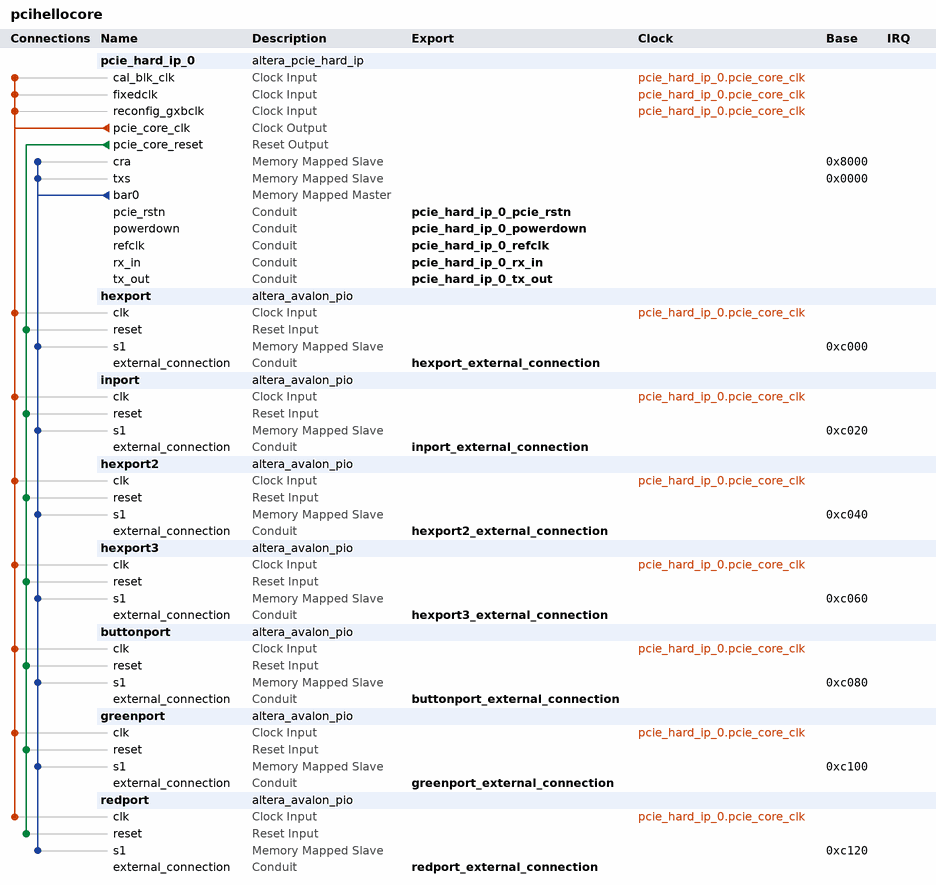
[diagram p0: system contents]
# Platform Designer (Qsys) system pcihellocore, Cyclone IV GX EP4CGX150DF31C7
# Parameters at their usual value, and those the tool derives, are not listed.
package require -exact qsys 20.1
create_system pcihellocore
set_project_property DEVICE_FAMILY {Cyclone IV GX}
set_project_property DEVICE EP4CGX150DF31C7

add_instance pcie_hard_ip_0 altera_pcie_hard_ip 20.1
set_instance_parameter_value pcie_hard_ip_0 {BAR Type} {32 bit Non-Prefetchable,Not used,Not used,Not used,Not used,Not used}
set_instance_parameter_value pcie_hard_ip_0 CB_A2P_ADDR_MAP_PASS_THRU_BITS 15
set_instance_parameter_value pcie_hard_ip_0 CG_ENABLE_A2P_INTERRUPT 0
set_instance_parameter_value pcie_hard_ip_0 CG_NO_CPL_REORDERING 0
set_instance_parameter_value pcie_hard_ip_0 {PCIe Address 31:0} 0x00000000,0x00000000,0x00000000,0x00000000,0x00000000,0x00000000,0x00000000,0x00000000,0x00000000,0x00000000,0x00000000,0x00000000,0x00000000,0x00000000,0x00000000,0x00000000
set_instance_parameter_value pcie_hard_ip_0 {PCIe Address 63:32} 0x00000000,0x00000000,0x00000000,0x00000000,0x00000000,0x00000000,0x00000000,0x00000000,0x00000000,0x00000000,0x00000000,0x00000000,0x00000000,0x00000000,0x00000000,0x00000000
set_instance_parameter_value pcie_hard_ip_0 class_code 0
set_instance_parameter_value pcie_hard_ip_0 device_id 4
set_instance_parameter_value pcie_hard_ip_0 my_advanced_errors false
set_instance_parameter_value pcie_hard_ip_0 my_enable_ecrc_check false
set_instance_parameter_value pcie_hard_ip_0 my_enable_ecrc_gen false
set_instance_parameter_value pcie_hard_ip_0 p_pcie_app_clk 1
set_instance_parameter_value pcie_hard_ip_0 p_pcie_test_out_width None
set_instance_parameter_value pcie_hard_ip_0 p_user_msi_enable 0
set_instance_parameter_value pcie_hard_ip_0 subsystem_device_id 4
set_instance_parameter_value pcie_hard_ip_0 subsystem_vendor_id 4466
set_instance_parameter_value pcie_hard_ip_0 vendor_id 4466

add_instance hexport altera_avalon_pio 20.1
set_instance_parameter_value hexport direction Output
set_instance_parameter_value hexport resetValue 1077952576
set_instance_parameter_value hexport width 32

add_instance inport altera_avalon_pio 20.1
set_instance_parameter_value inport direction Input
set_instance_parameter_value inport width 16

add_instance hexport2 altera_avalon_pio 20.1
set_instance_parameter_value hexport2 direction Output
set_instance_parameter_value hexport2 resetValue 16448
set_instance_parameter_value hexport2 width 16

add_instance hexport3 altera_avalon_pio 20.1
set_instance_parameter_value hexport3 direction Output
set_instance_parameter_value hexport3 resetValue 16448
set_instance_parameter_value hexport3 width 16

add_instance buttonport altera_avalon_pio 20.1
set_instance_parameter_value buttonport direction Output
set_instance_parameter_value buttonport resetValue 17
set_instance_parameter_value buttonport width 8

add_instance greenport altera_avalon_pio 20.1
set_instance_parameter_value greenport direction Output
set_instance_parameter_value greenport resetValue 255
set_instance_parameter_value greenport width 8

add_instance redport altera_avalon_pio 20.1
set_instance_parameter_value redport direction Output
set_instance_parameter_value redport resetValue 65535
set_instance_parameter_value redport width 16

# connections
add_connection pcie_hard_ip_0.pcie_core_clk buttonport.clk clock
add_connection pcie_hard_ip_0.pcie_core_clk greenport.clk clock
add_connection pcie_hard_ip_0.pcie_core_clk hexport2.clk clock
add_connection pcie_hard_ip_0.pcie_core_clk hexport3.clk clock
add_connection pcie_hard_ip_0.pcie_core_clk hexport.clk clock
add_connection pcie_hard_ip_0.pcie_core_clk inport.clk clock
add_connection pcie_hard_ip_0.pcie_core_clk pcie_hard_ip_0.cal_blk_clk clock
add_connection pcie_hard_ip_0.pcie_core_clk pcie_hard_ip_0.fixedclk clock
add_connection pcie_hard_ip_0.pcie_core_clk pcie_hard_ip_0.reconfig_gxbclk clock
add_connection pcie_hard_ip_0.pcie_core_clk redport.clk clock
add_connection pcie_hard_ip_0.pcie_core_reset buttonport.reset reset
add_connection pcie_hard_ip_0.pcie_core_reset greenport.reset reset
add_connection pcie_hard_ip_0.pcie_core_reset hexport2.reset reset
add_connection pcie_hard_ip_0.pcie_core_reset hexport3.reset reset
add_connection pcie_hard_ip_0.pcie_core_reset hexport.reset reset
add_connection pcie_hard_ip_0.pcie_core_reset inport.reset reset
add_connection pcie_hard_ip_0.pcie_core_reset redport.reset reset
add_connection pcie_hard_ip_0.bar0 buttonport.s1 avalon
set_connection_parameter_value pcie_hard_ip_0.bar0/buttonport.s1 baseAddress 0xc080
add_connection pcie_hard_ip_0.bar0 greenport.s1 avalon
set_connection_parameter_value pcie_hard_ip_0.bar0/greenport.s1 baseAddress 0xc100
add_connection pcie_hard_ip_0.bar0 hexport2.s1 avalon
set_connection_parameter_value pcie_hard_ip_0.bar0/hexport2.s1 baseAddress 0xc040
add_connection pcie_hard_ip_0.bar0 hexport3.s1 avalon
set_connection_parameter_value pcie_hard_ip_0.bar0/hexport3.s1 baseAddress 0xc060
add_connection pcie_hard_ip_0.bar0 hexport.s1 avalon
set_connection_parameter_value pcie_hard_ip_0.bar0/hexport.s1 baseAddress 0xc000
add_connection pcie_hard_ip_0.bar0 inport.s1 avalon
set_connection_parameter_value pcie_hard_ip_0.bar0/inport.s1 baseAddress 0xc020
add_connection pcie_hard_ip_0.bar0 pcie_hard_ip_0.cra avalon
set_connection_parameter_value pcie_hard_ip_0.bar0/pcie_hard_ip_0.cra baseAddress 0x8000
add_connection pcie_hard_ip_0.bar0 pcie_hard_ip_0.txs avalon
set_connection_parameter_value pcie_hard_ip_0.bar0/pcie_hard_ip_0.txs baseAddress 0x0000
add_connection pcie_hard_ip_0.bar0 redport.s1 avalon
set_connection_parameter_value pcie_hard_ip_0.bar0/redport.s1 baseAddress 0xc120

# exported interfaces
add_interface buttonport_external_connection conduit end
set_interface_property buttonport_external_connection EXPORT_OF buttonport.external_connection
add_interface greenport_external_connection conduit end
set_interface_property greenport_external_connection EXPORT_OF greenport.external_connection
add_interface hexport2_external_connection conduit end
set_interface_property hexport2_external_connection EXPORT_OF hexport2.external_connection
add_interface hexport3_external_connection conduit end
set_interface_property hexport3_external_connection EXPORT_OF hexport3.external_connection
add_interface hexport_external_connection conduit end
set_interface_property hexport_external_connection EXPORT_OF hexport.external_connection
add_interface inport_external_connection conduit end
set_interface_property inport_external_connection EXPORT_OF inport.external_connection
add_interface pcie_hard_ip_0_pcie_rstn conduit end
set_interface_property pcie_hard_ip_0_pcie_rstn EXPORT_OF pcie_hard_ip_0.pcie_rstn
add_interface pcie_hard_ip_0_powerdown conduit end
set_interface_property pcie_hard_ip_0_powerdown EXPORT_OF pcie_hard_ip_0.powerdown
add_interface pcie_hard_ip_0_refclk conduit end
set_interface_property pcie_hard_ip_0_refclk EXPORT_OF pcie_hard_ip_0.refclk
add_interface pcie_hard_ip_0_rx_in conduit end
set_interface_property pcie_hard_ip_0_rx_in EXPORT_OF pcie_hard_ip_0.rx_in
add_interface pcie_hard_ip_0_tx_out conduit end
set_interface_property pcie_hard_ip_0_tx_out EXPORT_OF pcie_hard_ip_0.tx_out
add_interface redport_external_connection conduit end
set_interface_property redport_external_connection EXPORT_OF redport.external_connection

set_interconnect_requirement {$system} qsys_mm.clockCrossingAdapter HANDSHAKE
set_interconnect_requirement {$system} qsys_mm.maxAdditionalLatency 1

save_system pcihellocore.qsys
